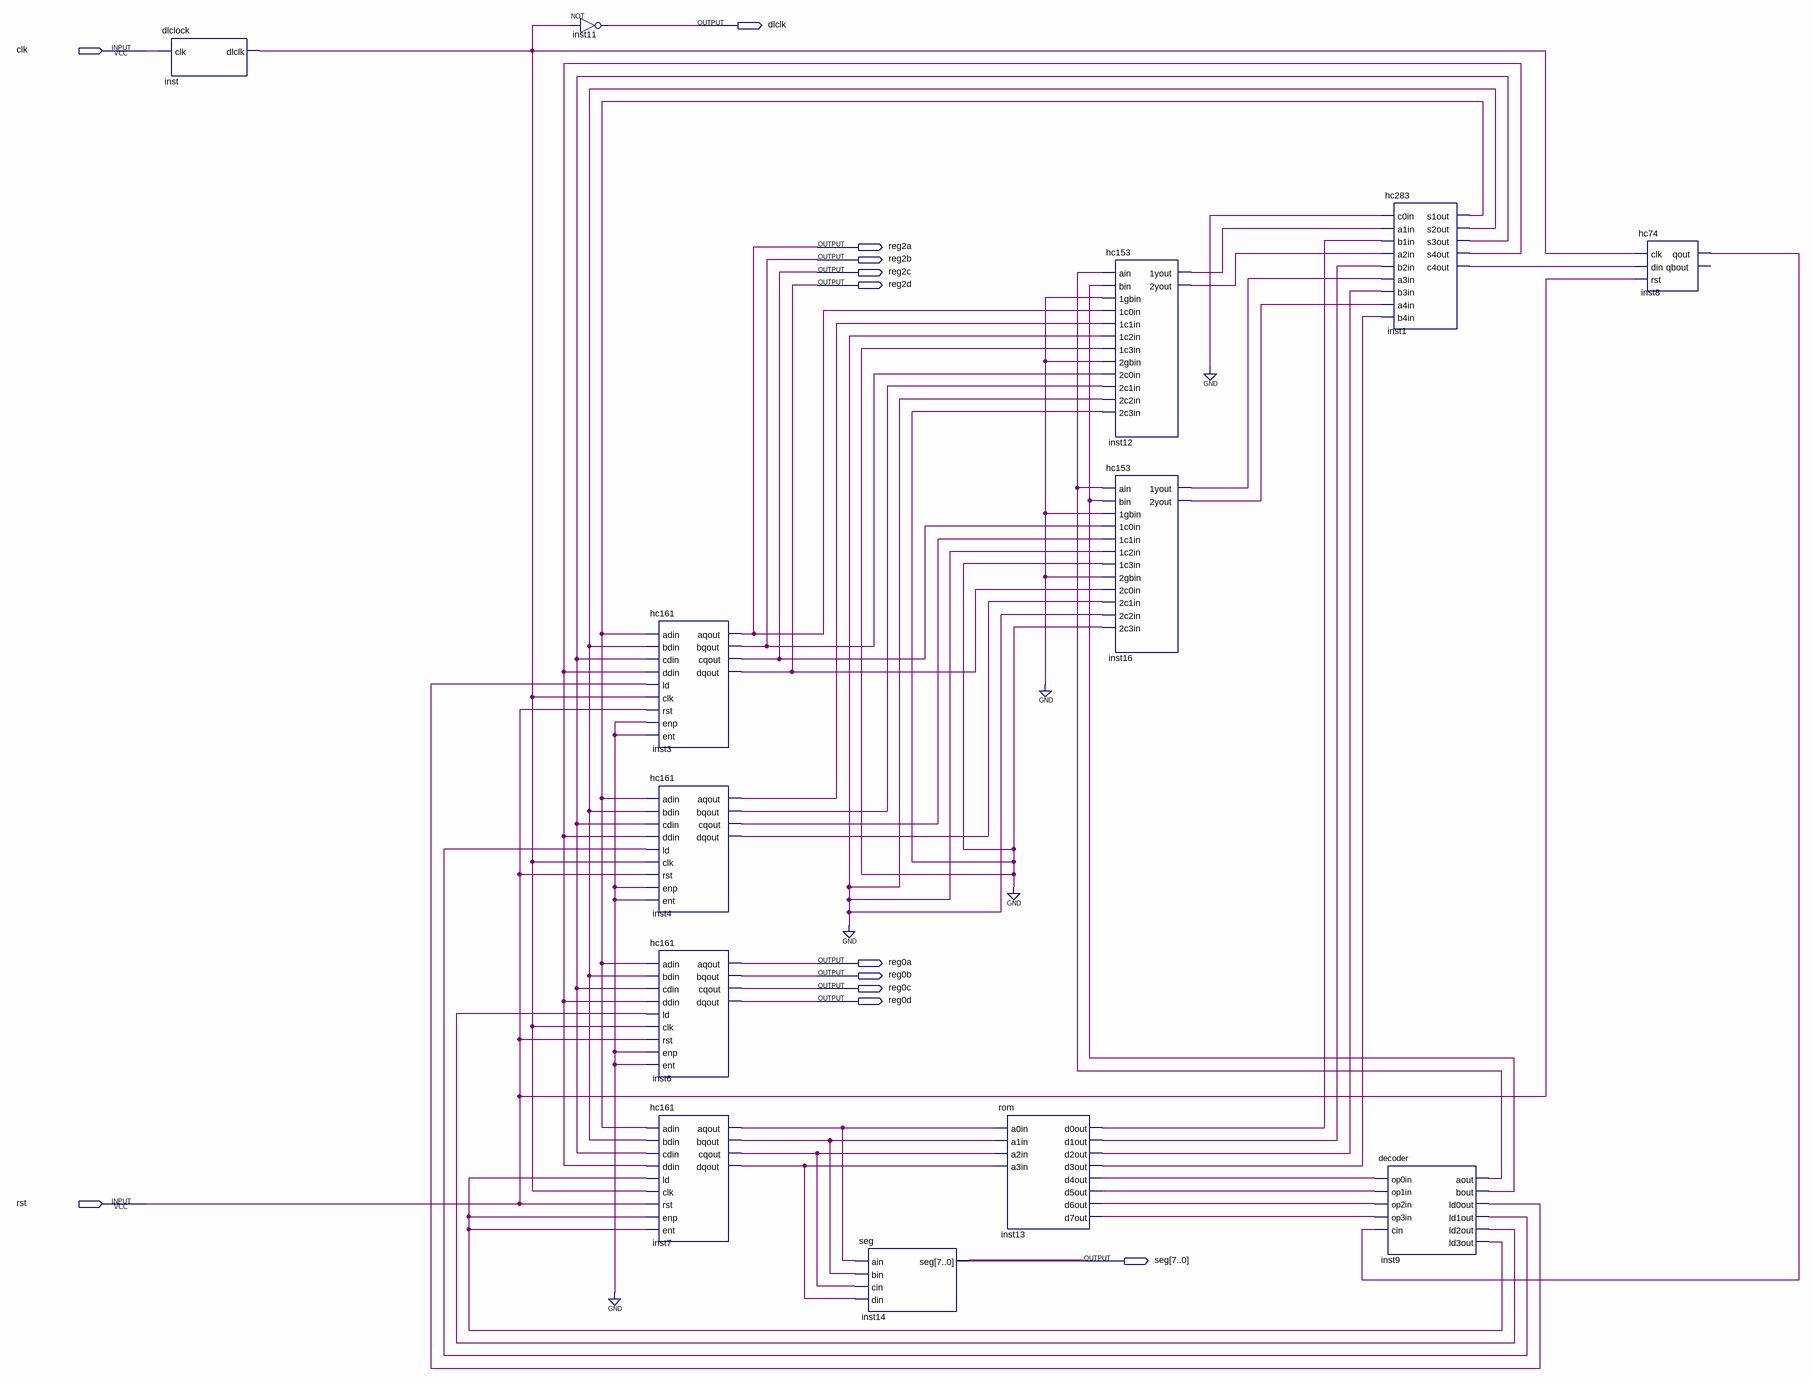
[diagram p0: schematic sheet]
// Quartus schematic test.bdf as structural Verilog: 13 symbols, 12 pins
module test (
  input  clk,
  input  rst,
  output dlclk,
  output reg2a,
  output reg2b,
  output reg2c,
  output reg2d,
  output reg0a,
  output reg0b,
  output reg0c,
  output reg0d,
  output [7:0] seg
);

  wire inst1_c4out, inst1_s1out, inst1_s2out, inst1_s3out, inst1_s4out, inst4_aqout, inst4_bqout,
       inst4_cqout, inst4_dqout, inst7_aqout, inst7_bqout, inst7_cqout, inst7_dqout, inst8_qout, inst9_aout,
       inst9_bout, inst9_ld0out, inst9_ld1out, inst9_ld2out, inst9_ld3out, inst12_1yout, inst12_2yout,
       inst13_d0out, inst13_d1out, inst13_d2out, inst13_d3out, inst13_d4out, inst13_d5out, inst13_d6out,
       inst13_d7out, inst16_1yout, inst16_2yout, inst_dlclk;

  dlclock inst (.clk(clk), .dlclk(inst_dlclk));
  not inst11 (dlclk, inst_dlclk);
  hc161 inst3 (
    .adin(inst1_s1out), .bdin(inst1_s2out), .cdin(inst1_s3out), .ddin(inst1_s4out), .ld(inst9_ld0out),
    .clk(inst_dlclk), .rst(rst), .enp(1'b0), .ent(1'b0), .aqout(reg2a), .bqout(reg2b), .cqout(reg2c),
    .dqout(reg2d));
  hc161 inst4 (
    .adin(inst1_s1out), .bdin(inst1_s2out), .cdin(inst1_s3out), .ddin(inst1_s4out), .ld(inst9_ld1out),
    .clk(inst_dlclk), .rst(rst), .enp(1'b0), .ent(1'b0), .aqout(inst4_aqout), .bqout(inst4_bqout),
    .cqout(inst4_cqout), .dqout(inst4_dqout));
  hc161 inst6 (
    .adin(inst1_s1out), .bdin(inst1_s2out), .cdin(inst1_s3out), .ddin(inst1_s4out), .ld(inst9_ld2out),
    .clk(inst_dlclk), .rst(rst), .enp(1'b0), .ent(1'b0), .aqout(reg0a), .bqout(reg0b), .cqout(reg0c),
    .dqout(reg0d));
  hc161 inst7 (
    .adin(inst1_s1out), .bdin(inst1_s2out), .cdin(inst1_s3out), .ddin(inst1_s4out), .ld(inst9_ld3out),
    .clk(inst_dlclk), .rst(rst), .enp(inst9_ld3out), .ent(inst9_ld3out), .aqout(inst7_aqout),
    .bqout(inst7_bqout), .cqout(inst7_cqout), .dqout(inst7_dqout));
  seg inst14 (.ain(inst7_aqout), .bin(inst7_bqout), .cin(inst7_cqout), .din(inst7_dqout), .seg(seg));
  rom inst13 (
    .a0in(inst7_aqout), .a1in(inst7_bqout), .a2in(inst7_cqout), .a3in(inst7_dqout), .d0out(inst13_d0out),
    .d1out(inst13_d1out), .d2out(inst13_d2out), .d3out(inst13_d3out), .d4out(inst13_d4out),
    .d5out(inst13_d5out), .d6out(inst13_d6out), .d7out(inst13_d7out));
  hc153 inst12 (
    .ain(inst9_aout), .bin(inst9_bout), .\1gbin (1'b0), .\1c0in (reg2a), .\1c1in (inst4_aqout),
    .\1c2in (1'b0), .\1c3in (1'b0), .\2gbin (1'b0), .\2c0in (reg2b), .\2c1in (inst4_bqout), .\2c2in (1'b0),
    .\2c3in (1'b0), .\1yout (inst12_1yout), .\2yout (inst12_2yout));
  hc153 inst16 (
    .ain(inst9_aout), .bin(inst9_bout), .\1gbin (1'b0), .\1c0in (reg2c), .\1c1in (inst4_cqout),
    .\1c2in (1'b0), .\1c3in (1'b0), .\2gbin (1'b0), .\2c0in (reg2d), .\2c1in (inst4_dqout), .\2c2in (1'b0),
    .\2c3in (1'b0), .\1yout (inst16_1yout), .\2yout (inst16_2yout));
  hc283 inst1 (
    .c0in(1'b0), .a1in(inst12_1yout), .b1in(inst13_d0out), .a2in(inst12_2yout), .b2in(inst13_d1out),
    .a3in(inst16_1yout), .b3in(inst13_d2out), .a4in(inst16_2yout), .b4in(inst13_d3out), .s1out(inst1_s1out),
    .s2out(inst1_s2out), .s3out(inst1_s3out), .s4out(inst1_s4out), .c4out(inst1_c4out));
  decoder inst9 (
    .op0in(inst13_d4out), .op1in(inst13_d5out), .op2in(inst13_d6out), .op3in(inst13_d7out), .cin(inst8_qout),
    .aout(inst9_aout), .bout(inst9_bout), .ld0out(inst9_ld0out), .ld1out(inst9_ld1out),
    .ld2out(inst9_ld2out), .ld3out(inst9_ld3out));
  hc74 inst8 (.clk(inst_dlclk), .din(inst1_c4out), .rst(rst), .qout(inst8_qout));  // open: qbout
endmodule
